# Altium schematic sheet Sheet1.SchDoc
size 762 x 762 mm
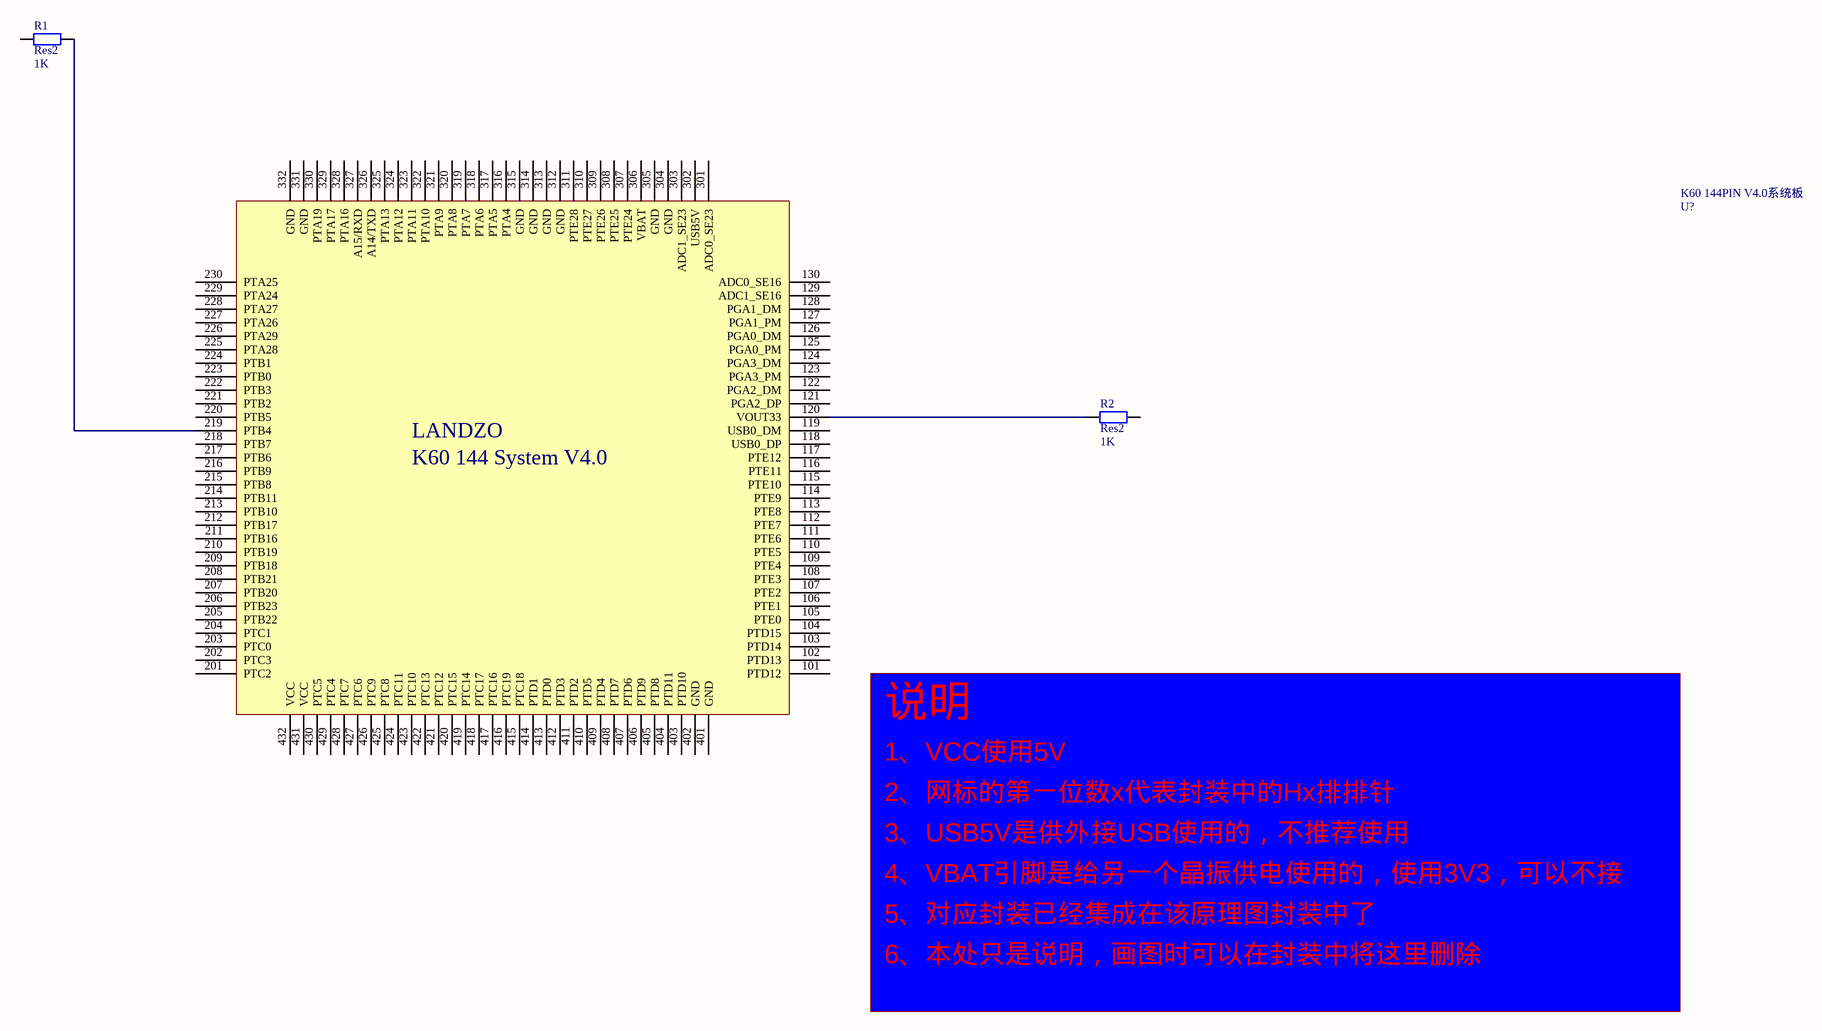
[diagram p0: Sheet1.SchDoc]

## Parts
K60_144PIN_V4.0系统板  U?  [K60 V4.0最小系统版]
R1  Res2  value 1K  [AXIAL-0.4]
R2  Res2  value 1K  [AXIAL-0.4]

## Nets
NetK60_144PIN_V4.0系统板_120: K60_144PIN_V4.0系统板.120(VOUT33) R2.1
NetK60_144PIN_V4.0系统板_219: K60_144PIN_V4.0系统板.219(PTB4) R1.2

Not connected (* = marked no-connect by the designer): K60_144PIN_V4.0系统板 101(PTD12) 102(PTD13) 103(PTD14) 104(PTD15) 105(PTE0) 106(PTE1) 107(PTE2) 108(PTE3) 109(PTE4) 110(PTE5) 111(PTE6) 112(PTE7) 113(PTE8) 114(PTE9) 115(PTE10) 116(PTE11) 117(PTE12) 118(USB0_DP) 119(USB0_DM) 121(PGA2_DP) 122(PGA2_DM) 123(PGA3_PM) 124(PGA3_DM) 125(PGA0_PM) 126(PGA0_DM) 127(PGA1_PM) 128(PGA1_DM) 129(ADC1_SE16) 130(ADC0_SE16) 201(PTC2) 202(PTC3) 203(PTC0) 204(PTC1) 205(PTB22) 206(PTB23) 207(PTB20) 208(PTB21) 209(PTB18) 210(PTB19) 211(PTB16) 212(PTB17) 213(PTB10) 214(PTB11) 215(PTB8) 216(PTB9) 217(PTB6) 218(PTB7) 220(PTB5) 221(PTB2) 222(PTB3) 223(PTB0) 224(PTB1) 225(PTA28) 226(PTA29) 227(PTA26) 228(PTA27) 229(PTA24) 230(PTA25) 301(ADC0_SE23) 302(USB5V) 303(ADC1_SE23) 304(GND) 305(GND) 306(VBAT) 307(PTE24) 308(PTE25) 309(PTE26) 310(PTE27) 311(PTE28) 312(GND) 313(GND) 314(GND) 315(GND) 316(PTA4) 317(PTA5) 318(PTA6) 319(PTA7) 320(PTA8) 321(PTA9) 322(PTA10) 323(PTA11) 324(PTA12) 325(PTA13) 326(A14/TXD) 327(A15/RXD) 328(PTA16) 329(PTA17) 330(PTA19) 331(GND) 332(GND) 401(GND) 402(GND) 403(PTD10) 404(PTD11) 405(PTD8) 406(PTD9) 407(PTD6) 408(PTD7) 409(PTD4) 410(PTD5) 411(PTD2) 412(PTD3) 413(PTD0) 414(PTD1) 415(PTC18) 416(PTC19) 417(PTC16) 418(PTC17) 419(PTC14) 420(PTC15) 421(PTC12) 422(PTC13) 423(PTC10) 424(PTC11) 425(PTC8) 426(PTC9) 427(PTC6) 428(PTC7) 429(PTC4) 430(PTC5) 431(VCC) 432(VCC); R1 1; R2 2

## Notes on the sheet
- (in symbol K60 144PIN V4.0系统板) LANDZO; K60 144 System V4.0; 说明; 1、VCC使用5V; 2、网标的第一位数x代表封装中的Hx排排针; 3、USB5V是供外接USB使用的，不推荐使用; 4、VBAT引脚是给另一个晶振供电使用的，使用3V3，可以不接; 5、对应封装已经集成在该原理图封装中了; 6、本处只是说明，画图时可以在封装中将这里删除

## Library data of the parts
K60_144PIN_V4.0系统板 = K60 144PIN V4.0系统板
R1 R2 = Res2: Resistor; Published: 8-Jun-2000; LatestRevisionDate: 17-Jul-2002; LatestRevisionNote: Re-released for DXP Platform.; PackageReference: AXIAL-0.4; Publisher: Altium Limited; PackageDescription: Axial Device, Thru-Hole; 2 Leads; 0.4 in Pin Spacing